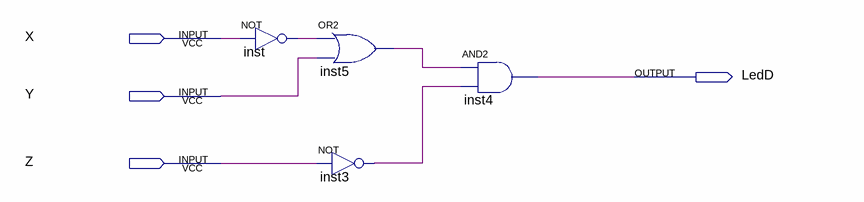
[diagram p0: schematic sheet]
// Quartus schematic LEDd.bdf as structural Verilog: 4 symbols, 4 pins
module LEDd (
  input  X,
  input  Y,
  input  Z,
  output LedD
);

  wire inst3_out, inst5_out, inst_out;

  not inst (inst_out, X);
  or inst5 (inst5_out, inst_out, Y);
  not inst3 (inst3_out, Z);
  and inst4 (LedD, inst5_out, inst3_out);
endmodule
